# EAGLE design CaricabatterieLite (EAGLE 4.16)
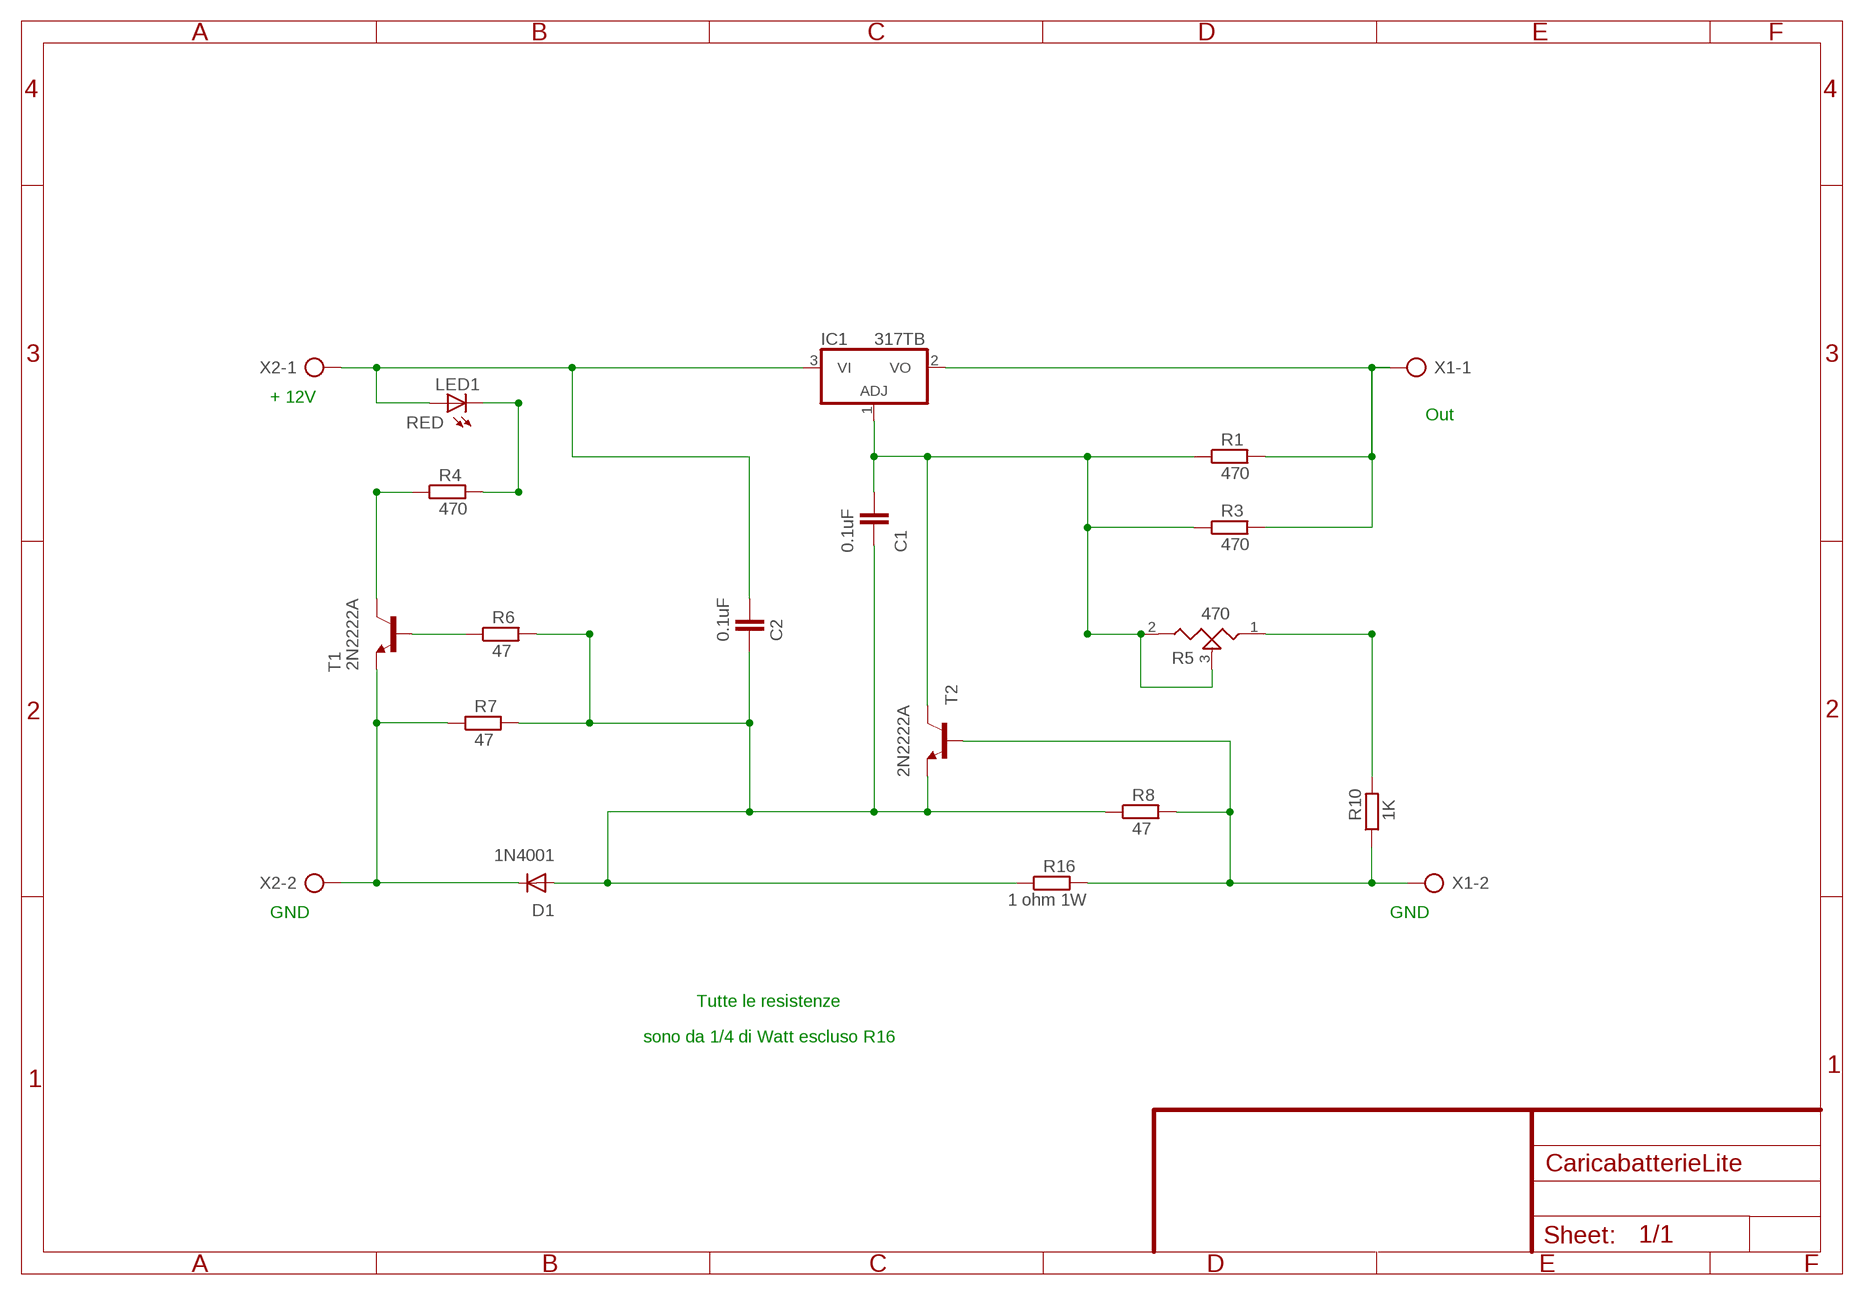
[diagram p0: schematic, sheet 1]

## Parts
C1  0.1uF  C-EU050-025X075  [C050-025X075]
C2  0.1uF  C-EU050-025X075  [C050-025X075]
D1  1N4001  1N4004  [DO41-10]
IC1  317TB  317T  [TO220H]
LED1  RED  LED5MM  [LED5MM]
R1  470  R-EU_0207/10  [0207/10]
R3  470  R-EU_0207/10  [0207/10]
R4  470  R-EU_0207/10  [0207/10]
R5  470  POTUS-L  [PT-10]
R6  47  R-EU_0207/10  [0207/10]
R7  47  R-EU_0207/10  [0207/10]
R8  47  R-EU_0207/10  [0207/10]
R10  1K  R-EU_0207/10  [0207/10]
R16  1 ohm 1W  R-EU_0411/15  [0411/15]
T1  2N2222A  2N2222  [TO18]
T2  2N2222A  2N2222  [TO18]
X1  AK300/2  [AK300/2]
X2  AK300/2  [AK300/2]

## Nets
N$1: R4.1 T1.3(C)
N$2: LED1.K(C) R4.2
N$3: IC1.2(VO) R1.2 R3.2 X1.1
N$4: R6.1 T1.2(B)
N$6: C2.1 IC1.3(VI) LED1.A X2.1
N$8: D1.C R7.1 T1.1(E) X2.2
N$9: C1.2 C2.2 D1.A R6.2 R7.2 R8.1 R16.1 T2.1(E)
N$10: R5.1 R10.2
N$11: C1.1 IC1.1(ADJ) R1.1 R3.1 R5.2 R5.3 T2.3(C)
N$13: R8.2 R10.1 R16.2 T2.2(B) X1.2

## Notes on the sheet
- + 12V
- Out
- GND | GND
- Tutte le resistenze
- sono da 1/4 di Watt escluso R16

## Library data of the parts
C1 C2 = rcl:C-EU: CAPACITOR, European symbol
D1 = diode:1N4004: DIODE general purpose rectifier, 1 A
IC1 = linear:*317: Positive VOLTAGE REGULATOR
LED1 = led:LED: LED OSRAM: - CHIPLED LG R971, LG N971, LY N971, LG Q971, LY Q971, LO R971, LY R971 LH N974, LH R974 LS Q976, LO Q976, LY Q976 LO Q996 - Hyper CHIPLED LW Q18S LB Q993, LB Q99A, LB R99A - SideLED LS A670, LO A670, LY A670, LG A670, LP A670 LB A673, LV A673, LT A673, LW A673 LH A674 LY A675 LS A676, LA A676, LO A676, LY A676, LW A676 LS A679, LY A679, LG A679 - Hyper Micro SIDELED® LS Y876, LA Y876, LO Y876, LY Y876 LT Y87S - SmartLED LW L88C, LW L88S LB L89C, LB L89S, LG L890 LS L89K, LO L89K, LY L89K LS L896, LA L896, LO L896, LY L896 - TOPLED LS T670, LO T670, LY T670, LG T670, LP T670 LSG T670, LSP T670, LSY T670, LOP T670, LYG T670 LG T671, LOG T671, LSG T671 LB T673, LV T673, LT T673, LW T673 LH T674 LS T676, LA T676, LO T676, LY T676, LB T676, LH T676, LSB T676, LW T676 LB T67C, LV T67C, LT T67C, LS T67K, LO T67K, LY T67K, LW E67C LS E67B, LA E67B, LO E67B, LY E67B, LB E67C, LV E67C, LT E67C LW T67C LS T679, LY T679, LG T679 LS T770, LO T770, LY T770, LG T770, LP T770 LB T773, LV T773, LT T773, LW T773 LH T774 LS E675, LA E675, LY E675, LS T675 LS T776, LA T776, LO T776, LY T776, LB T776 LHGB T686 LT T68C, LB T68C - Hyper Mini TOPLED® LB M676 - Mini TOPLED Santana® LG M470 LS M47K, LO M47K, LY M47K Source: http://www.osram.convergy.de/
R1 R3 R4 R6-R8 R10 R16 = rcl:R-EU_: RESISTOR, European symbol
R5 = discrete:POTUS-L
T1 T2 = transistor:2N2222: NPN TRANSISTOR
X1 X2 = con-ptr500:AK300/2: CONNECTOR

## Board
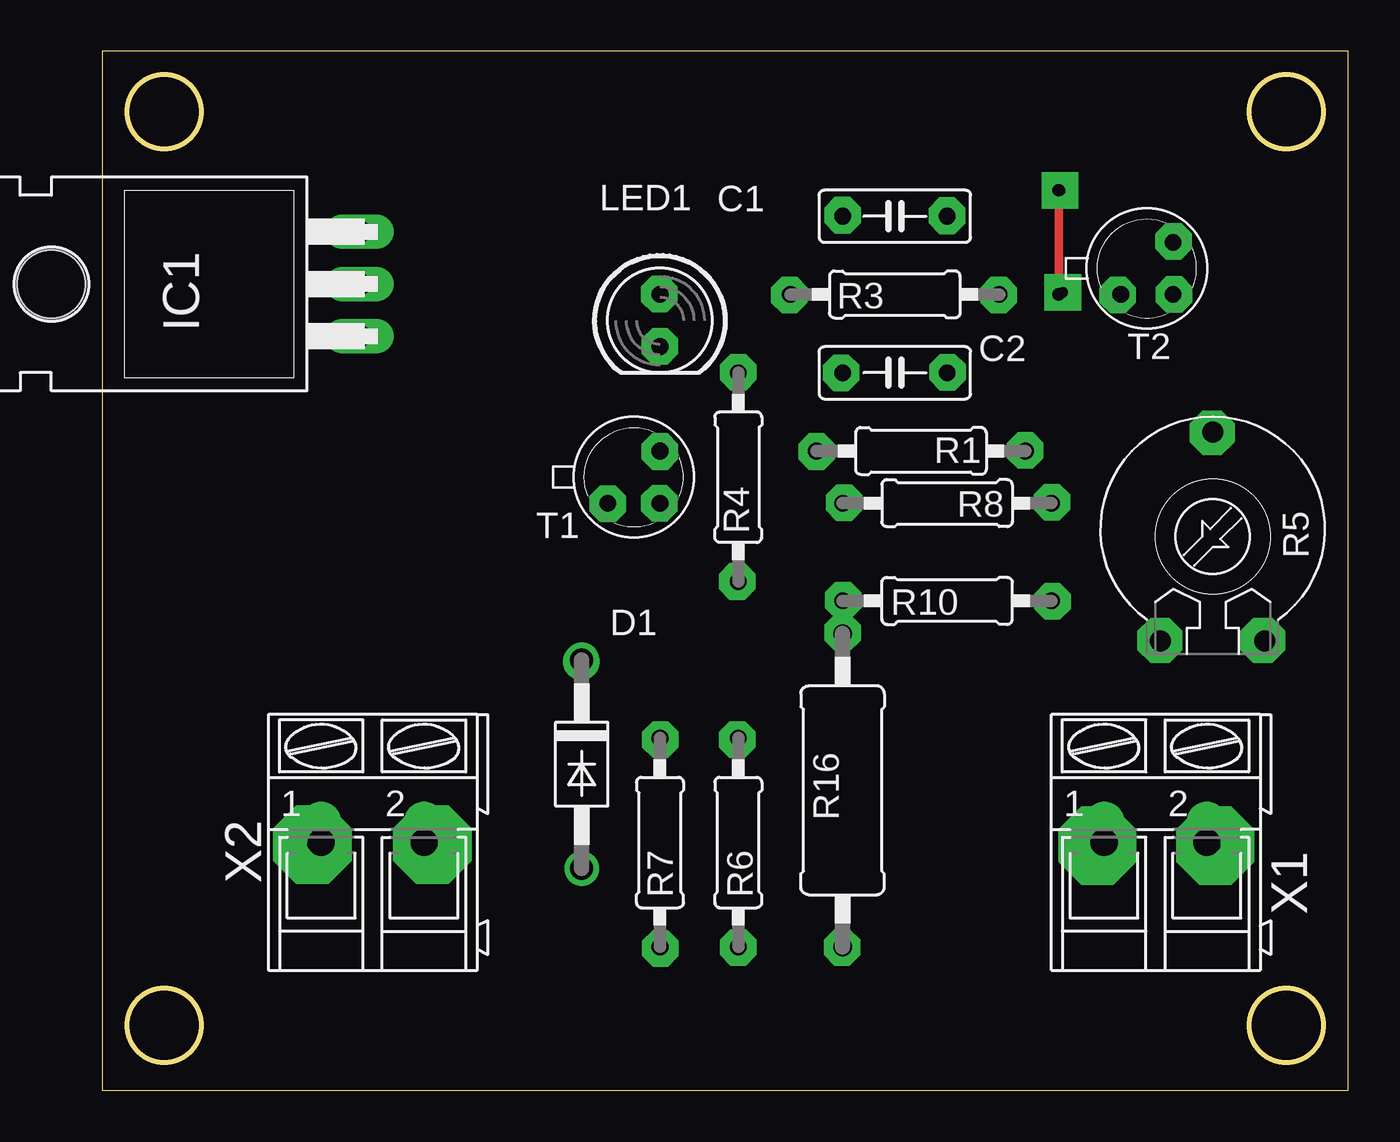
[diagram p1: board, top side]
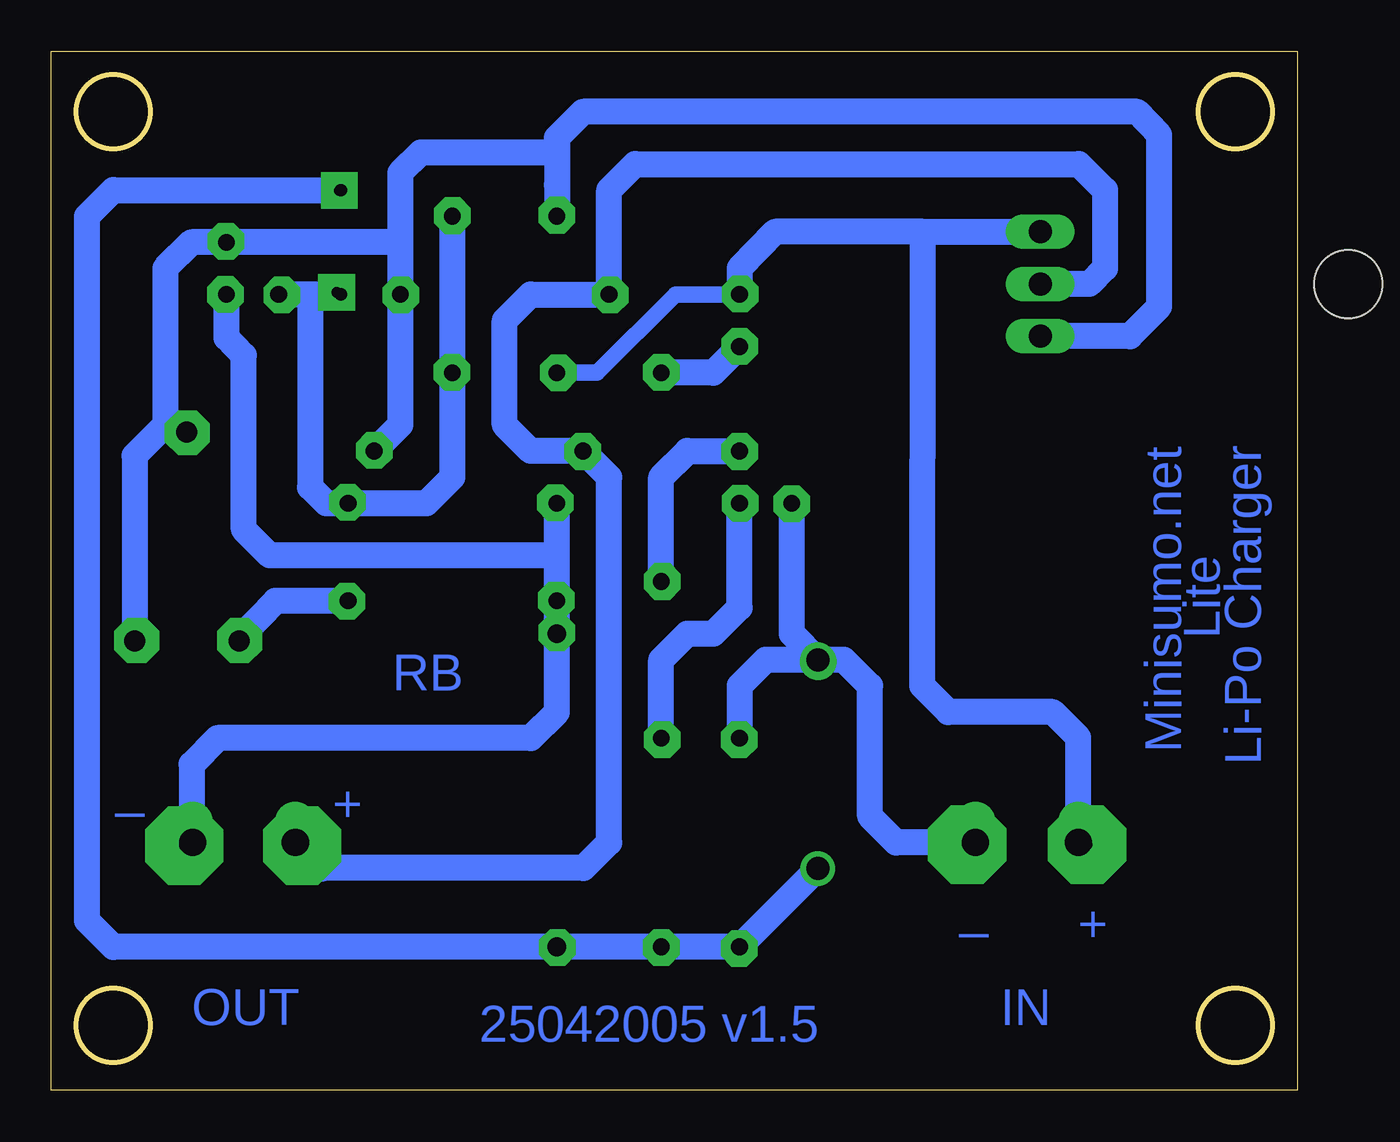
[diagram p2: board, bottom side, seen from below]

Size 60.63 x 50.56 mm. Coordinates in mm from the lower left corner, seen from the top.
Outline: 0,0 60.63,0 60.63,50.56 0,50.56 0,0
Outline: circle at 3.01,3.17 radius 1.8
Outline: circle at 57.62,3.17 radius 1.8
Outline: circle at 3.01,47.62 radius 1.8
Outline: circle at 57.62,47.62 radius 1.8
Copper layers (1*16): Top 0.035mm / dielectric 1.5mm / Bottom 0.03mm
Design rules "default": minimum track width 10mil, minimum drill 0.0005mm, track to track 8mil, track to pad 8mil, pad to pad 8mil, via to via 8mil, smd to smd 8mil, copper to edge 40mil, drill to drill 8mil, minimum pad ring 10mil, minimum via ring 8mil, stop-mask expansion 4mil, vias tented up to drill 0mil, thermal gap 10mil

### Footprints (pad centres in the part's own frame; a part is rotated, then mirrored left to right if it is on the bottom)
C050-025X075 = drill 0.813 octagon: 1 -2.54,0; 2 2.54,0
DO41-10 = drill 1.118 round: A 5.08,0; C -5.08,0
TO220H = drill 1.118 long: 1 -2.54,-10.16; 2 0,-10.16; 3 2.54,-10.16 | hole 3.302: 0,4.826
LED5MM = drill 0.813 octagon: A -1.27,0; K 1.27,0
0207/10 = drill 0.813 octagon: 1 -5.08,0; 2 5.08,0
PT-10 = drill 1.016 pad 1.778 octagon: 1 -2.54,-5.08; 2 2.54,-5.08; 3 0,5.08
0411/15 = drill 0.914 octagon: 1 -7.62,0; 2 7.62,0
TO18 = drill 0.813 octagon: 1 -1.27,-1.27; 2 1.27,-1.27; 3 1.27,1.27
AK300/2 = drill 1.321 long: 1 -2.515,0; 2 2.489,0

### Placement (x,y rotation side)
C1  38.57,42.54 0 top
C2  38.57,34.92 0 top
D1  23.33,15.87 270 top
IC1  2.35,39.24 90 top
LED1  27.14,37.46 270 top
R1  39.84,31.11 180 top
R3  38.57,38.73 180 top
R4  30.95,29.84 90 top
R5  54.04,26.94 0 top
R6  30.95,12.06 270 top
R7  27.14,12.06 270 top
R8  41.11,28.57 180 top
R10  41.11,23.82 0 top
R16  36.03,14.6 90 top
T1  25.87,29.84 0 top
T2  50.84,40 0 top
X1  51.27,12.06 0 top
X2  13.17,12.06 0 top

### Tracks (layer width: path | path; a pad name or v marks a point on that pad's centre or on a via)
N$1
  Bottom 1.27: R4.1 30.95,29.84 29.68,31.11 T1.3
N$2
  Bottom 1.27: R4.2 28.41,34.92 LED1.K
N$3
  Bottom 0.406: 47.44,10.82 47.46,10.79
  Bottom 1.27: 47.46,10.79 X1.1 | 47.44,10.82 34.73,10.82 33.49,12.06 33.49,29.84 R1.2 37.3,31.11 38.57,32.38 38.57,37.46 37.3,38.73 R3.2 33.49,43.81 32.22,45.08 10.63,45.08 9.36,43.81 9.36,40 10.12,39.24 IC1.2
N$4
  Bottom 1.27: R6.1 30.95,20.95 29.68,22.22 28.41,22.22 27.14,23.49 T1.2
N$5  (via drill 0.5 pad 1.42)
  other vias: 12.54,41.8
N$6  (via drill 0.5 pad 1.78)
  Bottom 0.406: 12.33,41.8 IC1.3
  Bottom 0.813: LED1.A 30.26,38.73 34.07,34.92 v35.95,34.92 C2.1 | 13.12,41.78 12.33,41.8
  Bottom 1.27: X2.1 10.65,17.16 11.9,18.41 16.98,18.41 18.25,19.68 18.22,41.78 | LED1.A 27.14,40 25.41,41.78 18.22,41.78 | 18.22,41.78 13.12,41.78
N$7  (via drill 0.5 pad 1.42)
  other vias: 12.54,39.26
N$8  (via drill 0.5 pad 1.78)
  Bottom 0.406: v24.6,28.54 T1.1
  Bottom 1.27: R7.1 27.14,19.68 25.87,20.95 D1.C | v24.6,28.54 24.6,22.22 D1.C | X2.2 19.52,12.06 20.79,13.33 20.79,19.68 22.06,20.95 D1.C
N$9  (via drill 0.5 pad 1.78, 0.6)
  Top 0.406: v46.55,43.81 v46.55,38.73
  Bottom 0.406: 48.12,38.73 48.04,38.73
  Bottom 1.27: D1.A R7.2 R6.2 R16.1 57.62,6.98 58.89,8.25 58.89,42.54 57.62,43.81 v46.55,43.81 | C1.2 C2.2 41.11,29.84 42.38,28.57 R8.1 47.26,28.57 48.04,29.36 48.04,38.73 | T2.1 48.12,38.73 v46.55,38.73
  other vias: 46.62,43.78 46.75,38.83
N$10
  Bottom 0.813: 51.5,21.99 R5.1
  Bottom 1.27: 51.5,21.99 49.72,23.82 R10.2
N$11
  Bottom 1.27: 43.65,41.27 43.65,44.65 42.66,45.64 36.03,45.64 | 43.65,41.27 R3.1 43.65,32.38 R1.1 | C1.1 36.03,44.06 36.03,45.64 | 43.65,41.27 T2.3 53.81,41.27 55.08,40 55.08,32.38 | R5.2 56.58,30.88 55.08,32.38 | R5.3 54.72,32.02 55.08,32.38 | IC1.1 8.14,36.7 6.72,38.15 6.72,46.5 7.79,47.62 34.76,47.62 36.03,46.35 36.03,45.64
N$12  (via drill 0.5 pad 1.42)
  other vias: 12.56,36.72
N$13  (via drill 0.5 pad 1.78)
  Bottom 0.813: 53.76,13.33 53.76,13.38
  Bottom 1.27: 36.03,26.03 50,26.03 51.27,27.3 51.27,35.76 52.11,36.62 T2.2 | X1.2 53.76,13.33 53.81,13.33 53.81,15.87 52.54,17.14 37.3,17.14 36.03,18.41 R16.2 v36.03,22.27 R10.1 36.03,26.03 | 36.03,26.03 R8.2
N$14  (via drill 0.5 pad 3.81)
  other vias: 10.22,11.96
N$15  (via drill 0.5 pad 3.81)
  other vias: 16.07,11.96
N$16  (via drill 0.5 pad 1.78)
  other vias: 36,6.95
N$17  (via drill 0.5 pad 3.81)
  other vias: 54.17,11.91
N$18  (via drill 0.5 pad 3.81)
  other vias: 48.43,11.91
N$25  (via drill 0.5 pad 2.18)
  other vias: 51.47,21.89
N$26  (via drill 0.5 pad 2.18)
  other vias: 56.48,21.89
N$27  (via drill 0.5 pad 2.18)
  other vias: 54.01,32
N$28  (via drill 0.5 pad 1.78)
  other vias: 49.42,38.7
N$32  (via drill 0.5 pad 1.78)
  other vias: 52.16,38.73
N$33  (via drill 0.5 pad 1.78)
  other vias: 52.13,41.32
N$34  (via drill 0.5 pad 1.78)
  other vias: 41.14,34.95
N$35  (via drill 0.5 pad 1.78)
  other vias: 41.11,42.57
N$36  (via drill 0.5 pad 1.78)
  other vias: 34.76,31.08
N$37  (via drill 0.5 pad 1.78)
  other vias: 44.92,31.14
N$38  (via drill 0.5 pad 1.78)
  other vias: 46.22,28.62
N$39  (via drill 0.5 pad 1.78)
  other vias: 36.11,28.6
N$40  (via drill 0.5 pad 1.78)
  other vias: 36.06,23.85
N$41  (via drill 0.5 pad 1.78)
  other vias: 46.24,23.79
N$56  (via drill 0.5 pad 1.78)
  other vias: 30.9,24.76
N$57  (via drill 0.5 pad 1.78)
  other vias: 30.9,17.06
N$58  (via drill 0.5 pad 1.78)
  other vias: 27.17,17.06
N$59  (via drill 0.5 pad 1.78)
  other vias: 30.95,6.95
N$60  (via drill 0.5 pad 1.78)
  other vias: 27.17,6.9
N$61  (via drill 0.5 pad 1.27)
  other vias: 23.3,10.79
N$62  (via drill 0.5 pad 1.78)
  other vias: 23.3,20.85
N$65  (via drill 0.5 pad 1.78)
  other vias: 27.11,28.57
N$66  (via drill 0.5 pad 1.78)
  other vias: 27.14,31.08
N$68  (via drill 0.5 pad 1.78)
  other vias: 30.95,34.95
N$69  (via drill 0.5 pad 1.78)
  other vias: 27.14,36.22
N$70  (via drill 0.5 pad 1.78)
  other vias: 27.11,38.76
N$72  (via drill 0.5 pad 1.78)
  other vias: 43.62,38.7
N$73  (via drill 0.5 pad 1.78)
  other vias: 36.03,42.59
N$75  (via drill 0.5 pad 1.78)
  other vias: 33.44,38.7

### Text on the board
Bottom: Li-Po Charger | Minisumo.net | Lite | RB | + | _ | + | _ | IN | OUT | 25042005 v1.5